# EasyEDA schematic easda-schema.json
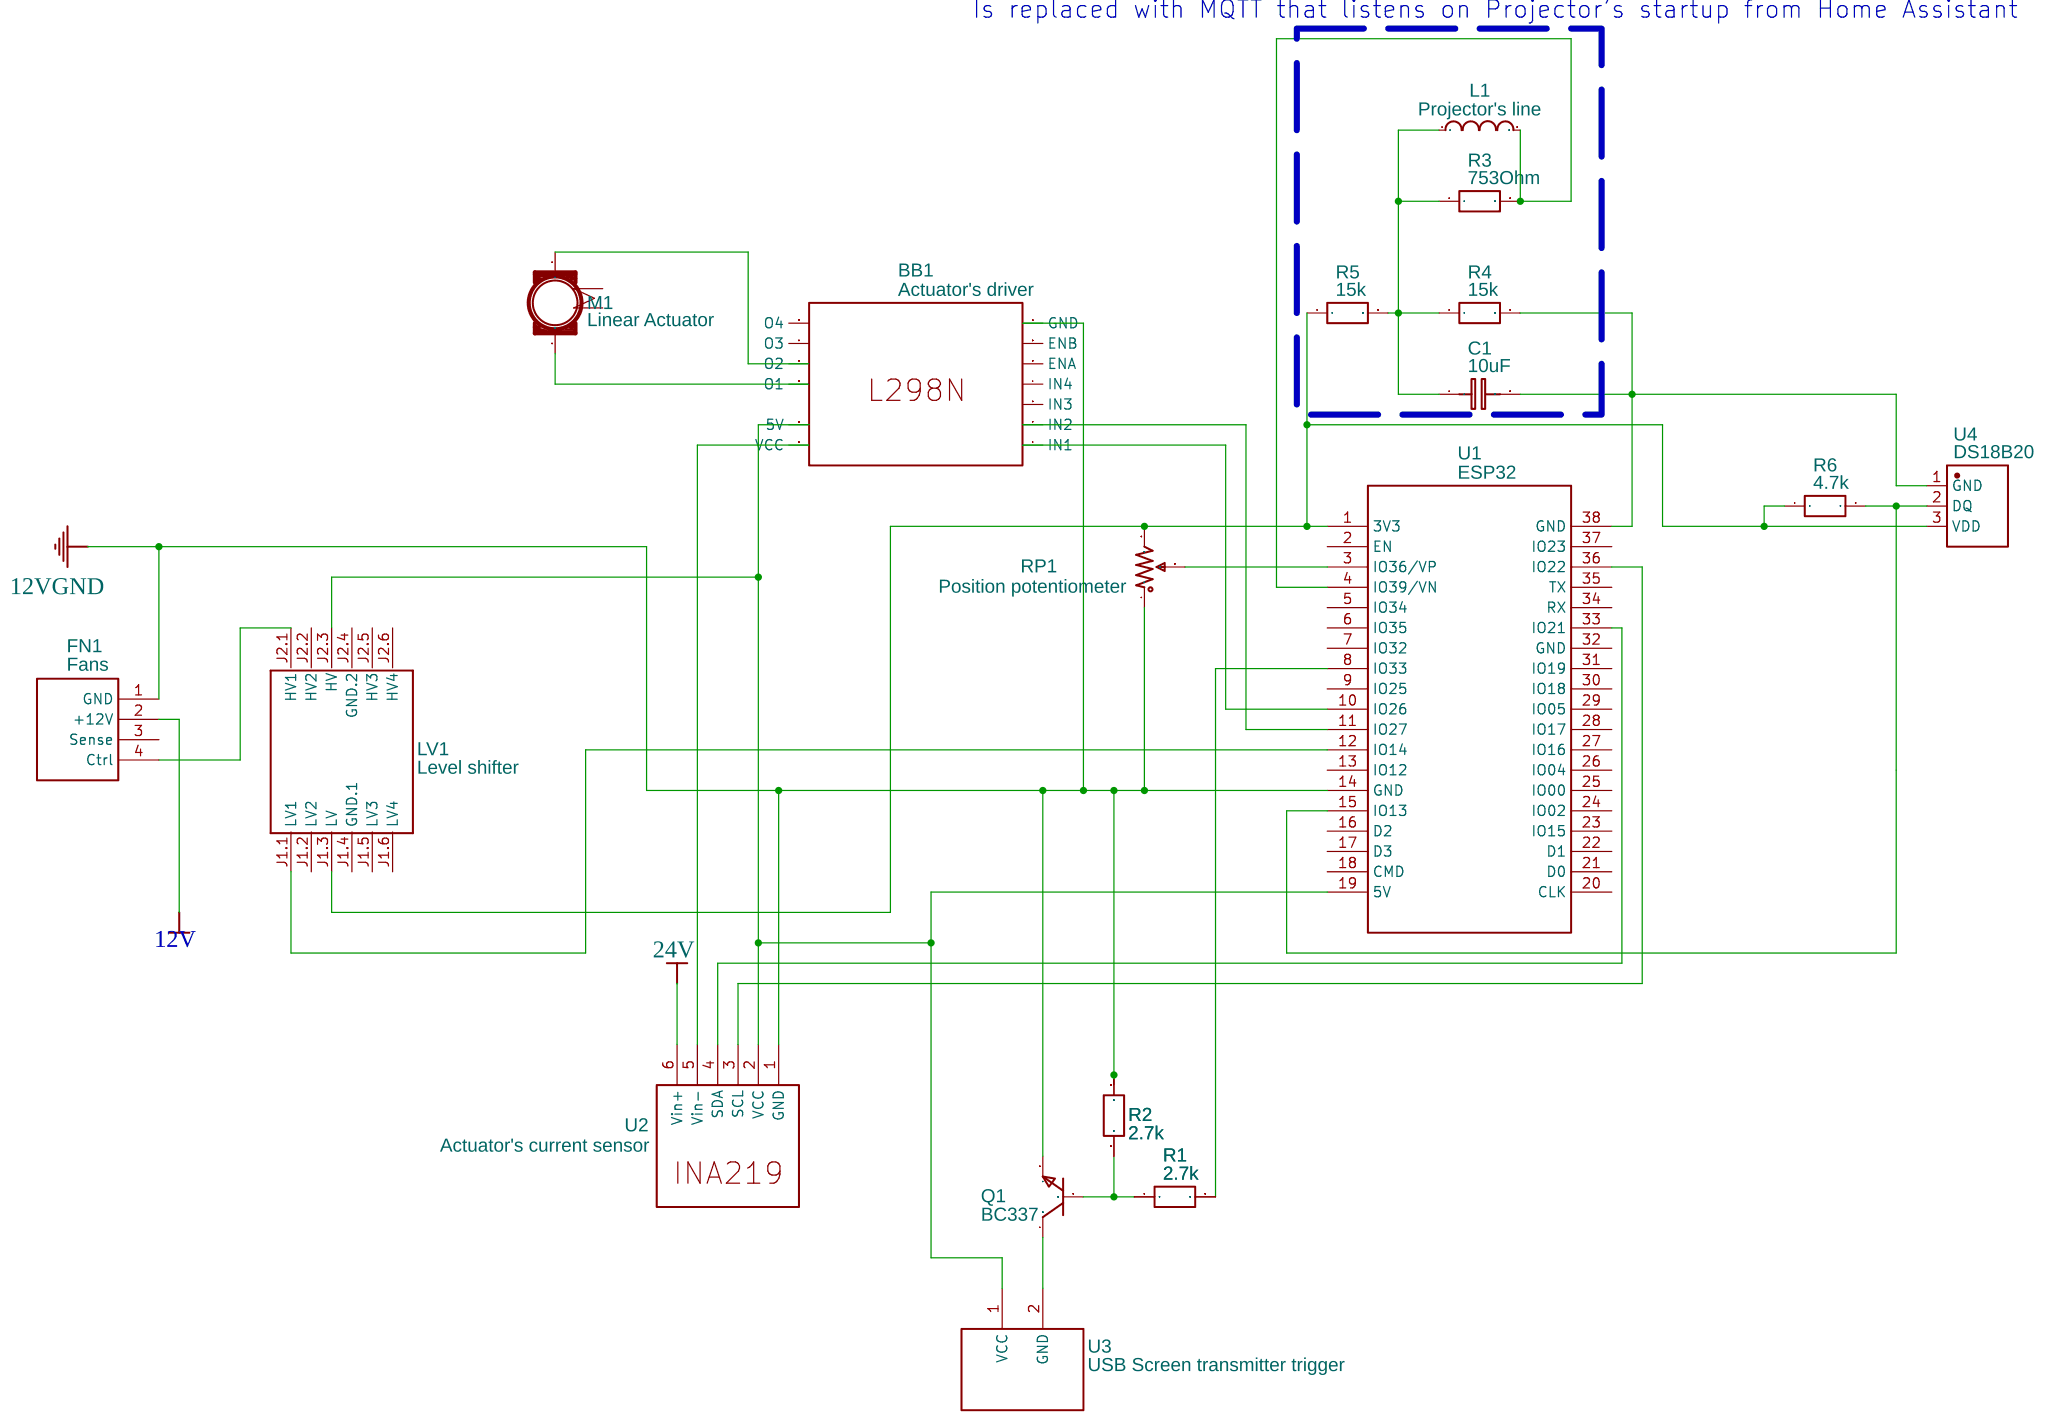
[diagram p0: schematic sheet]

## Parts
BB1  Actuator's driver  [L298N_2]
C1  10uF  [C0603]
FN1  Fans  [4 PIN PWM FAN HEADER]
L1  Projector's line  [L0603]
LV1  Level shifter  [LEVEL-SHIFTER-4CH]
M1  Linear Actuator  [MOTOR_DC]
Q1  BC337  [TO-92-3_L4.9-W3.7-P1.27-L]
R1  2.7k  [R0603]
R2  2.7k  [R0603]
R3  753Ohm  [R0603]
R4  15k  [R0603]
R5  15k  [R0603]
R6  4.7k  [R0603]
RP1  Position potentiometer  [RES-ADJ-TH_3386P]
U1  ESP32  [ESP32-WROOM-32-D-U-DEVKIT-DOUBLE]
U2  Actuator's current sensor  [GY-INA219]
U3  USB Screen transmitter trigger  [USB2-A-POWER-SOCKET]
U4  DS18B20  [TO-92-3_L4.9-W3.7-P1.27-L]

## Library data of the parts
BB1 = L298N Breakout Board: Contributor: V3K1C4
C1 = C_0603_EU: Contributor: LCEDA_Lib
FN1 = 4 Pin PWM Fan Header: Contributor: reakevin.05
L1 = L0603_US: Contributor: LCEDA_Lib
LV1 = LEVEL-SHIFTER-4CH: Contributor: giaava
M1 = Motor_DC
Q1 = BC337: Supplier Part: C154963; Supplier: LCSC; Manufacturer: CJ(江苏长电/长晶); Contributor: LCSC; JLCPCB Part Class: Extended Part
R1-R6 = R_0603_EU: Contributor: LCEDA_Lib
RP1 = R_3386P_US: Supplier: LCSC; Contributor: LCEDA_Lib; value(Ω): 10K
U1 = ESP32-WROOM-32-D-U-DEVKIT-DOUBLE: Contributor: KOXOV
U2 = INA219: Contributor: 8enjoe
U3 = USB2-A-2P-FEMALE-SOCKET: Contributor: kreizlie
U4 = DS18B20: Supplier: LCSC; Supplier Part: C376006; Manufacturer: UMW(广东友台半导体); Contributor: LCSC; JLCPCB Part Class: Extended Part

## Nets
12V: FN1.2(+12V)
12VGND: BB1.9(GND) FN1.1(GND) Q1.3(E) R2.2 RP1.1 U1.14(GND) U2.1(GND)
24V: U2.6(Vin+)
Net-(BB1-1): BB1.1(IN1) U1.10(IO26)
Net-(BB1-2): BB1.2(IN2) U1.11(IO27)
Net-(BB1-12): BB1.12(O2) M1.1
Net-(BB1-13): BB1.13(O1) M1.2
Net-(BB1-14): BB1.14(VCC) U2.5(Vin-)
Net-(BB1-15): BB1.15(5V) LV1.J2.3(HV) U1.19(5V) U2.2(VCC) U3.1(VCC)
Net-(C1-1): C1.1 L1.1 R3.1 R4.1 R5.2
Net-(C1-2): C1.2 R4.2 U1.38(GND) U4.1(GND)
Net-(FN1-4): FN1.4(Ctrl) LV1.J2.1(HV1)
Net-(L1-2): L1.2 R3.2 U1.4(IO39/VN)
Net-(LV1-J1.1): LV1.J1.1(LV1) U1.12(IO14)
Net-(LV1-J1.3): LV1.J1.3(LV) R5.1 R6.1 RP1.3 U1.1(3V3) U4.3(VDD)
Net-(Q1-1): Q1.1(C) U3.2(GND)
Net-(Q1-2): Q1.2(B) R1.1 R2.1
Net-(R1-2): R1.2 U1.8(IO33)
Net-(R6-2): R6.2 U1.15(IO13) U4.2(DQ)
Net-(RP1-2): RP1.2 U1.3(IO36/VP)
Net-(U1-33): U1.33(IO21) U2.4(SDA)
Net-(U1-36): U1.36(IO22) U2.3(SCL)

Not connected (* = marked no-connect by the designer): BB1 3(IN3) 4(IN4) 5(ENA) 6(ENB) 10(O4) 11(O3); FN1 3(Sense); LV1 J1.2(LV2) J1.4(GND.1) J1.5(LV3) J1.6(LV4) J2.2(HV2) J2.4(GND.2) J2.5(HV3) J2.6(HV4); U1 2(EN) 5(IO34) 6(IO35) 7(IO32) 9(IO25) 13(IO12) 16(D2) 17(D3) 18(CMD) 20(CLK) 21(D0) 22(D1) 23(IO15) 24(IO02) 25(IO00) 26(IO04) 27(IO16) 28(IO17) 29(IO05) 30(IO18) 31(IO19) 32(GND) 34(RX) 35(TX) 37(IO23)

## Notes on the sheet
- Is replaced with MQTT that listens on Projector's startup from Home Assistant
